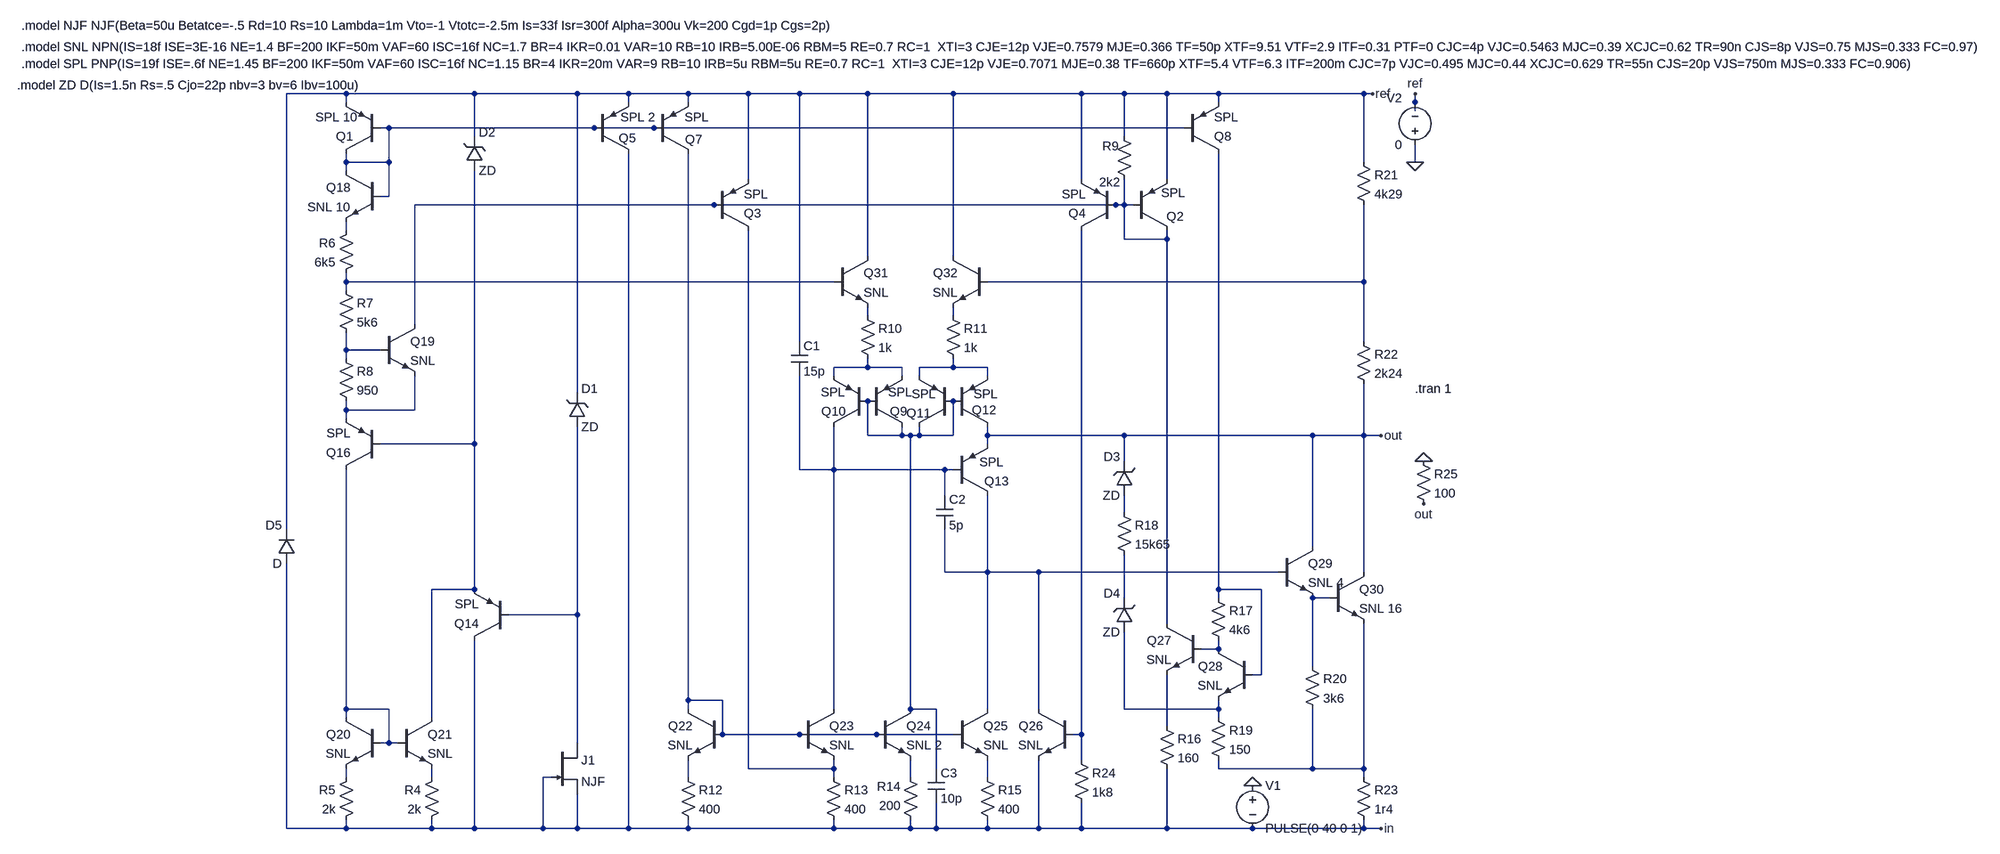
[diagram p0: schematic 79L05test.asc]
79L05test.asc, the LTspice schematic file:
Version 4
SHEET 1 5476 776
WIRE 1888 -736 1776 -736
WIRE 2128 -736 1888 -736
WIRE 2320 -736 2128 -736
WIRE 2416 -736 2320 -736
WIRE 2528 -736 2416 -736
WIRE 2640 -736 2528 -736
WIRE 2736 -736 2640 -736
WIRE 2864 -736 2736 -736
WIRE 3024 -736 2864 -736
WIRE 3264 -736 3024 -736
WIRE 3344 -736 3264 -736
WIRE 3424 -736 3344 -736
WIRE 3520 -736 3424 -736
WIRE 3792 -736 3520 -736
WIRE 3808 -736 3792 -736
WIRE 1888 -720 1888 -736
WIRE 2416 -720 2416 -736
WIRE 2528 -720 2528 -736
WIRE 3520 -720 3520 -736
WIRE 3888 -720 3888 -736
WIRE 3888 -704 3888 -720
WIRE 1968 -672 1952 -672
WIRE 2352 -672 1968 -672
WIRE 2464 -672 2352 -672
WIRE 3456 -672 2464 -672
WIRE 2128 -656 2128 -736
WIRE 3344 -656 3344 -736
WIRE 1888 -608 1888 -624
WIRE 1968 -608 1968 -672
WIRE 1968 -608 1888 -608
WIRE 3792 -608 3792 -736
WIRE 3888 -608 3888 -640
WIRE 1888 -592 1888 -608
WIRE 2640 -576 2640 -736
WIRE 3264 -576 3264 -736
WIRE 3424 -576 3424 -736
WIRE 1968 -544 1968 -608
WIRE 1968 -544 1952 -544
WIRE 2576 -528 2016 -528
WIRE 3328 -528 2576 -528
WIRE 3344 -528 3344 -576
WIRE 3344 -528 3328 -528
WIRE 3360 -528 3344 -528
WIRE 1888 -480 1888 -496
WIRE 3344 -464 3344 -528
WIRE 3424 -464 3424 -480
WIRE 3424 -464 3344 -464
WIRE 2864 -432 2864 -736
WIRE 3024 -432 3024 -736
WIRE 1888 -384 1888 -400
WIRE 2800 -384 1888 -384
WIRE 3792 -384 3792 -528
WIRE 3792 -384 3088 -384
WIRE 1888 -368 1888 -384
WIRE 2864 -320 2864 -336
WIRE 3024 -320 3024 -336
WIRE 2016 -304 2016 -528
WIRE 2736 -272 2736 -736
WIRE 3792 -272 3792 -384
WIRE 1888 -256 1888 -288
WIRE 1952 -256 1888 -256
WIRE 1888 -240 1888 -256
WIRE 2864 -224 2864 -240
WIRE 2864 -224 2800 -224
WIRE 2928 -224 2864 -224
WIRE 3024 -224 3024 -240
WIRE 3024 -224 2960 -224
WIRE 3088 -224 3024 -224
WIRE 2800 -208 2800 -224
WIRE 2928 -208 2928 -224
WIRE 2960 -208 2960 -224
WIRE 3088 -208 3088 -224
WIRE 2320 -176 2320 -736
WIRE 1888 -144 1888 -160
WIRE 2016 -144 2016 -208
WIRE 2016 -144 1888 -144
WIRE 1888 -128 1888 -144
WIRE 2864 -96 2864 -160
WIRE 2928 -96 2928 -112
WIRE 2928 -96 2864 -96
WIRE 2944 -96 2928 -96
WIRE 2960 -96 2960 -112
WIRE 2960 -96 2944 -96
WIRE 3024 -96 3024 -160
WIRE 3024 -96 2960 -96
WIRE 3088 -96 3088 -112
WIRE 3344 -96 3088 -96
WIRE 3696 -96 3344 -96
WIRE 3792 -96 3792 -192
WIRE 3792 -96 3696 -96
WIRE 3824 -96 3792 -96
WIRE 2128 -80 2128 -592
WIRE 2128 -80 1952 -80
WIRE 3088 -80 3088 -96
WIRE 3344 -48 3344 -96
WIRE 2736 -32 2736 -208
WIRE 2800 -32 2800 -112
WIRE 2800 -32 2736 -32
WIRE 3008 -32 2800 -32
WIRE 3024 -32 3008 -32
WIRE 3008 16 3008 -32
WIRE 3344 48 3344 16
WIRE 1776 80 1776 -736
WIRE 3696 112 3696 -96
WIRE 3008 160 3008 80
WIRE 3088 160 3088 16
WIRE 3088 160 3008 160
WIRE 3184 160 3088 160
WIRE 3632 160 3184 160
WIRE 3792 160 3792 -96
WIRE 2128 192 2128 -80
WIRE 2128 192 2048 192
WIRE 3520 192 3520 -624
WIRE 3600 192 3520 192
WIRE 3344 208 3344 128
WIRE 3520 208 3520 192
WIRE 3728 208 3696 208
WIRE 2320 240 2320 -112
WIRE 2320 240 2192 240
WIRE 3424 256 3424 -464
WIRE 3520 304 3520 288
WIRE 3520 304 3488 304
WIRE 3696 336 3696 208
WIRE 3600 352 3600 192
WIRE 3600 352 3584 352
WIRE 2528 400 2528 -624
WIRE 2592 400 2528 400
WIRE 1888 416 1888 -32
WIRE 1968 416 1888 416
WIRE 2528 416 2528 400
WIRE 2800 416 2800 -32
WIRE 2944 416 2944 -96
WIRE 2992 416 2944 416
WIRE 3088 416 3088 160
WIRE 3184 416 3184 160
WIRE 3344 416 3344 272
WIRE 3520 416 3520 400
WIRE 3520 416 3344 416
WIRE 1888 432 1888 416
WIRE 2048 432 2048 192
WIRE 3520 432 3520 416
WIRE 3424 448 3424 352
WIRE 2592 464 2592 400
WIRE 2736 464 2592 464
WIRE 2880 464 2736 464
WIRE 3024 464 2880 464
WIRE 3264 464 3264 -480
WIRE 3264 464 3248 464
WIRE 1968 480 1968 416
WIRE 1968 480 1952 480
WIRE 1984 480 1968 480
WIRE 2320 480 2320 240
WIRE 3264 512 3264 464
WIRE 2640 528 2640 -480
WIRE 2800 528 2800 512
WIRE 2800 528 2640 528
WIRE 2992 528 2992 416
WIRE 3520 528 3520 512
WIRE 3696 528 3696 416
WIRE 3696 528 3520 528
WIRE 3792 528 3792 256
WIRE 3792 528 3696 528
WIRE 1888 544 1888 528
WIRE 2048 544 2048 528
WIRE 2272 544 2256 544
WIRE 2528 544 2528 512
WIRE 2800 544 2800 528
WIRE 2944 544 2944 512
WIRE 3088 544 3088 512
WIRE 3792 544 3792 528
WIRE 1776 640 1776 144
WIRE 1888 640 1888 624
WIRE 1888 640 1776 640
WIRE 2048 640 2048 624
WIRE 2048 640 1888 640
WIRE 2128 640 2128 288
WIRE 2128 640 2048 640
WIRE 2256 640 2256 544
WIRE 2256 640 2128 640
WIRE 2320 640 2320 576
WIRE 2320 640 2256 640
WIRE 2416 640 2416 -624
WIRE 2416 640 2320 640
WIRE 2528 640 2528 624
WIRE 2528 640 2416 640
WIRE 2800 640 2800 624
WIRE 2800 640 2528 640
WIRE 2944 640 2944 624
WIRE 2944 640 2800 640
WIRE 2992 640 2992 592
WIRE 2992 640 2944 640
WIRE 3088 640 3088 624
WIRE 3088 640 2992 640
WIRE 3184 640 3184 512
WIRE 3184 640 3088 640
WIRE 3264 640 3264 592
WIRE 3264 640 3184 640
WIRE 3424 640 3424 528
WIRE 3424 640 3264 640
WIRE 3584 640 3424 640
WIRE 3792 640 3792 624
WIRE 3792 640 3584 640
WIRE 3824 640 3792 640
FLAG 3824 640 in
FLAG 3824 -96 out
FLAG 3584 560 0
FLAG 3904 -48 0
FLAG 3904 32 out
FLAG 3888 -608 0
FLAG 3808 -736 ref
FLAG 3888 -736 ref
SYMBOL res 2064 528 M0
SYMATTR InstName R4
SYMATTR Value 2k
SYMBOL res 1904 528 M0
SYMATTR InstName R5
SYMATTR Value 2k
SYMBOL res 1904 -496 M0
SYMATTR InstName R6
SYMATTR Value 6k5
SYMBOL res 1872 -384 R0
SYMATTR InstName R7
SYMATTR Value 5k6
SYMBOL res 1872 -256 R0
SYMATTR InstName R8
SYMATTR Value 950
SYMBOL res 3328 -672 R0
WINDOW 0 -25 34 Left 0
WINDOW 3 -31 102 Left 0
SYMATTR InstName R9
SYMATTR Value 2k2
SYMBOL res 2848 -336 R0
SYMATTR InstName R10
SYMATTR Value 1k
SYMBOL res 3008 -336 R0
SYMATTR InstName R11
SYMATTR Value 1k
SYMBOL res 2512 528 R0
SYMATTR InstName R12
SYMATTR Value 400
SYMBOL res 2784 528 R0
SYMATTR InstName R13
SYMATTR Value 400
SYMBOL res 2928 528 R0
WINDOW 0 -47 33 Left 0
WINDOW 3 -43 69 Left 0
SYMATTR InstName R14
SYMATTR Value 200
SYMBOL res 3072 528 R0
SYMATTR InstName R15
SYMATTR Value 400
SYMBOL res 3408 432 R0
SYMATTR InstName R16
SYMATTR Value 160
SYMBOL res 3504 192 R0
SYMATTR InstName R17
SYMATTR Value 4k6
SYMBOL res 3328 32 R0
SYMATTR InstName R18
SYMATTR Value 15k65
SYMBOL res 3504 416 R0
SYMATTR InstName R19
SYMATTR Value 150
SYMBOL res 3680 320 R0
SYMATTR InstName R20
SYMATTR Value 3k6
SYMBOL res 3776 -624 R0
SYMATTR InstName R21
SYMATTR Value 4k29
SYMBOL res 3776 -288 R0
SYMATTR InstName R22
SYMATTR Value 2k24
SYMBOL res 3776 528 R0
SYMATTR InstName R23
SYMATTR Value 1r4
SYMBOL res 3248 496 R0
SYMATTR InstName R24
SYMATTR Value 1k8
SYMBOL cap 2720 -272 R0
SYMATTR InstName C1
SYMATTR Value 15p
SYMBOL cap 2992 16 R0
SYMATTR InstName C2
SYMATTR Value 5p
SYMBOL cap 2976 528 R0
SYMATTR InstName C3
SYMATTR Value 10p
SYMBOL zener 2304 -112 M180
WINDOW 0 24 72 Left 0
WINDOW 3 24 0 Left 0
SYMATTR InstName D1
SYMATTR Value ZD
SYMBOL zener 2112 -592 M180
WINDOW 0 24 72 Left 0
WINDOW 3 24 0 Left 0
SYMATTR InstName D2
SYMATTR Value ZD
SYMBOL zener 3360 16 R180
WINDOW 0 24 72 Left 0
WINDOW 3 24 0 Left 0
SYMATTR InstName D3
SYMATTR Value ZD
SYMBOL zener 3360 272 R180
WINDOW 0 24 72 Left 0
WINDOW 3 24 0 Left 0
SYMATTR InstName D4
SYMATTR Value ZD
SYMBOL pnp 1952 -624 R180
WINDOW 0 51 32 Left 0
WINDOW 3 43 68 Left 0
SYMATTR InstName Q1
SYMATTR Value SPL 10
SYMBOL pnp 3360 -480 M180
WINDOW 0 63 26 Left 0
WINDOW 3 53 70 Left 0
SYMATTR InstName Q2
SYMATTR Value SPL
SYMBOL pnp 2576 -480 M180
SYMATTR InstName Q3
SYMATTR Value SPL
SYMBOL pnp 3328 -480 R180
SYMATTR InstName Q4
SYMATTR Value SPL
SYMBOL pnp 2352 -624 M180
WINDOW 0 46 29 Left 0
WINDOW 3 49 68 Left 0
SYMATTR InstName Q5
SYMATTR Value SPL 2
SYMBOL pnp 2464 -624 M180
WINDOW 0 58 26 Left 0
WINDOW 3 57 68 Left 0
SYMATTR InstName Q7
SYMATTR Value SPL
SYMBOL pnp 3456 -624 M180
SYMATTR InstName Q8
SYMATTR Value SPL
SYMBOL pnp 2864 -112 M180
WINDOW 0 41 29 Left 0
WINDOW 3 38 65 Left 0
SYMATTR InstName Q9
SYMATTR Value SPL
SYMBOL pnp 2864 -112 R180
WINDOW 0 41 29 Left 0
WINDOW 3 43 65 Left 0
SYMATTR InstName Q10
SYMATTR Value SPL
SYMBOL pnp 3024 -112 R180
WINDOW 0 42 26 Left 0
WINDOW 3 33 62 Left 0
SYMATTR InstName Q11
SYMATTR Value SPL
SYMBOL pnp 3024 -112 M180
WINDOW 0 35 32 Left 0
WINDOW 3 38 62 Left 0
SYMATTR InstName Q12
SYMATTR Value SPL
SYMBOL pnp 3024 16 M180
WINDOW 0 58 26 Left 0
WINDOW 3 49 62 Left 0
SYMATTR InstName Q13
SYMATTR Value SPL
SYMBOL pnp 2192 288 R180
SYMATTR InstName Q14
SYMATTR Value SPL
SYMBOL pnp 1952 -32 R180
SYMATTR InstName Q16
SYMATTR Value SPL
SYMBOL npn 1952 -592 M0
SYMATTR InstName Q18
SYMATTR Value SNL 10
SYMBOL npn 1952 -304 R0
SYMATTR InstName Q19
SYMATTR Value SNL
SYMBOL npn 1952 432 M0
SYMATTR InstName Q20
SYMATTR Value SNL
SYMBOL npn 1984 432 R0
SYMATTR InstName Q21
SYMATTR Value SNL
SYMBOL npn 2592 416 M0
SYMATTR InstName Q22
SYMATTR Value SNL
SYMBOL npn 2736 416 R0
SYMATTR InstName Q23
SYMATTR Value SNL
SYMBOL npn 2880 416 R0
SYMATTR InstName Q24
SYMATTR Value SNL 2
SYMBOL npn 3024 416 R0
SYMATTR InstName Q25
SYMATTR Value SNL
SYMBOL npn 3248 416 M0
SYMATTR InstName Q26
SYMATTR Value SNL
SYMBOL npn 3488 256 M0
SYMATTR InstName Q27
SYMATTR Value SNL
SYMBOL npn 3584 304 M0
SYMATTR InstName Q28
SYMATTR Value SNL
SYMBOL npn 3632 112 R0
SYMATTR InstName Q29
SYMATTR Value SNL 4
SYMBOL npn 3728 160 R0
SYMATTR InstName Q30
SYMATTR Value SNL 16
SYMBOL npn 2800 -432 R0
SYMATTR InstName Q31
SYMATTR Value SNL
SYMBOL npn 3088 -432 M0
SYMATTR InstName Q32
SYMATTR Value SNL
SYMBOL njf 2272 480 R0
SYMATTR InstName J1
SYMBOL voltage 3584 544 R0
WINDOW 123 0 0 Left 0
WINDOW 39 0 0 Left 0
SYMATTR InstName V1
SYMATTR Value PULSE(0 40 0 1)
SYMBOL res 3888 -64 R0
SYMATTR InstName R25
SYMATTR Value 100
SYMBOL voltage 3888 -624 R180
WINDOW 0 24 104 Left 0
WINDOW 3 24 16 Left 0
WINDOW 123 0 0 Left 0
WINDOW 39 0 0 Left 0
SYMATTR InstName V2
SYMATTR Value 0
SYMBOL diode 1792 144 R180
WINDOW 0 24 72 Left 0
WINDOW 3 24 0 Left 0
SYMATTR InstName D5
TEXT 3888 -184 Left 0 !.tran 1
TEXT 1272 -752 Left 0 !.model ZD D(Is=1.5n Rs=.5 Cjo=22p nbv=3 bv=6 Ibv=100u)
TEXT 1280 -824 Left 0 !.model SNL NPN(IS=18f ISE=3E-16 NE=1.4 BF=200 IKF=50m VAF=60 ISC=16f NC=1.7 BR=4 IKR=0.01 VAR=10 RB=10 IRB=5.00E-06 RBM=5 RE=0.7 RC=1  XTI=3 CJE=12p VJE=0.7579 MJE=0.366 TF=50p XTF=9.51 VTF=2.9 ITF=0.31 PTF=0 CJC=4p VJC=0.5463 MJC=0.39 XCJC=0.62 TR=90n CJS=8p VJS=0.75 MJS=0.333 FC=0.97)
TEXT 1280 -792 Left 0 !.model SPL PNP(IS=19f ISE=.6f NE=1.45 BF=200 IKF=50m VAF=60 ISC=16f NC=1.15 BR=4 IKR=20m VAR=9 RB=10 IRB=5u RBM=5u RE=0.7 RC=1  XTI=3 CJE=12p VJE=0.7071 MJE=0.38 TF=660p XTF=5.4 VTF=6.3 ITF=200m CJC=7p VJC=0.495 MJC=0.44 XCJC=0.629 TR=55n CJS=20p VJS=750m MJS=0.333 FC=0.906)
TEXT 1280 -864 Left 0 !.model NJF NJF(Beta=50u Betatce=-.5 Rd=10 Rs=10 Lambda=1m Vto=-1 Vtotc=-2.5m Is=33f Isr=300f Alpha=300u Vk=200 Cgd=1p Cgs=2p)

The netlist it stands for:
* 79L05test.asc
R4 N030 in 2k
R5 N029 in 2k
R6 N003 N004 6k5
R7 N004 N008 5k6
R8 N008 N011 950
R9 ref N002 2k2
R10 N006 N009 1k
R11 N007 N010 1k
R12 N031 in 400
R13 N027 in 400
R14 N032 in 200
R15 N033 in 400
R16 N025 in 160
R17 N017 N021 4k6
R18 N015 N018 15k65
R19 N024 N028 150
R20 N019 N028 3k6
R21 ref N005 4k29
R22 N005 out 2k24
R23 N028 in 1r4
R24 N026 in 1k8
C1 ref N014 15p
C2 N014 N016 5p
C3 N012 in 10p
D1 N020 ref ZD
D2 N013 ref ZD
D3 N015 out ZD
D4 N024 N018 ZD
Q1 N001 N001 ref 0 SPL 10
Q2 N002 N002 ref 0 SPL
Q3 N027 N002 ref 0 SPL
Q4 N026 N002 ref 0 SPL
Q5 in N001 ref 0 SPL 2
Q7 N022 N001 ref 0 SPL
Q8 N017 N001 ref 0 SPL
Q9 N012 N012 N009 0 SPL
Q10 N014 N012 N009 0 SPL
Q11 N012 N012 N010 0 SPL
Q12 out N012 N010 0 SPL
Q13 N016 N014 out 0 SPL
Q14 in N020 N013 0 SPL
Q16 N023 N013 N011 0 SPL
Q18 N001 N001 N003 0 SNL 10
Q19 N002 N008 N011 0 SNL
Q20 N023 N023 N029 0 SNL
Q21 N013 N023 N030 0 SNL
Q22 N022 N022 N031 0 SNL
Q23 N014 N022 N027 0 SNL
Q24 N012 N022 N032 0 SNL 2
Q25 N016 N022 N033 0 SNL
Q26 N016 N026 in 0 SNL
Q27 N002 N021 N025 0 SNL
Q28 N021 N017 N024 0 SNL
Q29 out N016 N019 0 SNL 4
Q30 out N019 N028 0 SNL 16
Q31 ref N004 N006 0 SNL
Q32 ref N005 N007 0 SNL
J1 N020 in in NJF
V1 0 in PULSE(0 40 0 1)
R25 0 out 100
V2 0 ref 0
D5 in ref D
.model D D
.lib standard.dio
.model NPN NPN
.model PNP PNP
.lib standard.bjt
.model NJF NJF
.model PJF PJF
.lib standard.jft
.tran 1
.model ZD D(Is=1.5n Rs=.5 Cjo=22p nbv=3 bv=6 Ibv=100u)
.model SNL NPN(IS=18f ISE=3E-16 NE=1.4 BF=200 IKF=50m VAF=60 ISC=16f NC=1.7 BR=4 IKR=0.01 VAR=10 RB=10 IRB=5.00E-06 RBM=5 RE=0.7 RC=1  XTI=3 CJE=12p VJE=0.7579 MJE=0.366 TF=50p XTF=9.51 VTF=2.9 ITF=0.31 PTF=0 CJC=4p VJC=0.5463 MJC=0.39 XCJC=0.62 TR=90n CJS=8p VJS=0.75 MJS=0.333 FC=0.97)
.model SPL PNP(IS=19f ISE=.6f NE=1.45 BF=200 IKF=50m VAF=60 ISC=16f NC=1.15 BR=4 IKR=20m VAR=9 RB=10 IRB=5u RBM=5u RE=0.7 RC=1  XTI=3 CJE=12p VJE=0.7071 MJE=0.38 TF=660p XTF=5.4 VTF=6.3 ITF=200m CJC=7p VJC=0.495 MJC=0.44 XCJC=0.629 TR=55n CJS=20p VJS=750m MJS=0.333 FC=0.906)
.model NJF NJF(Beta=50u Betatce=-.5 Rd=10 Rs=10 Lambda=1m Vto=-1 Vtotc=-2.5m Is=33f Isr=300f Alpha=300u Vk=200 Cgd=1p Cgs=2p)
.backanno
.end